# EasyEDA Pro project ReuseBlock_MSDriver2.0_2025-01-31.epro

# Schematic MSDriver2.0
Board Name: Board1; Create Date: 2025-01-27; Page Name: P1; Project Name: MSDriver(Ver2.0); Schematic Name: Schematic1; Update Date: 2025-01-29; Company: 嘉立创EDA; Page Size: A4; Version: V1.0
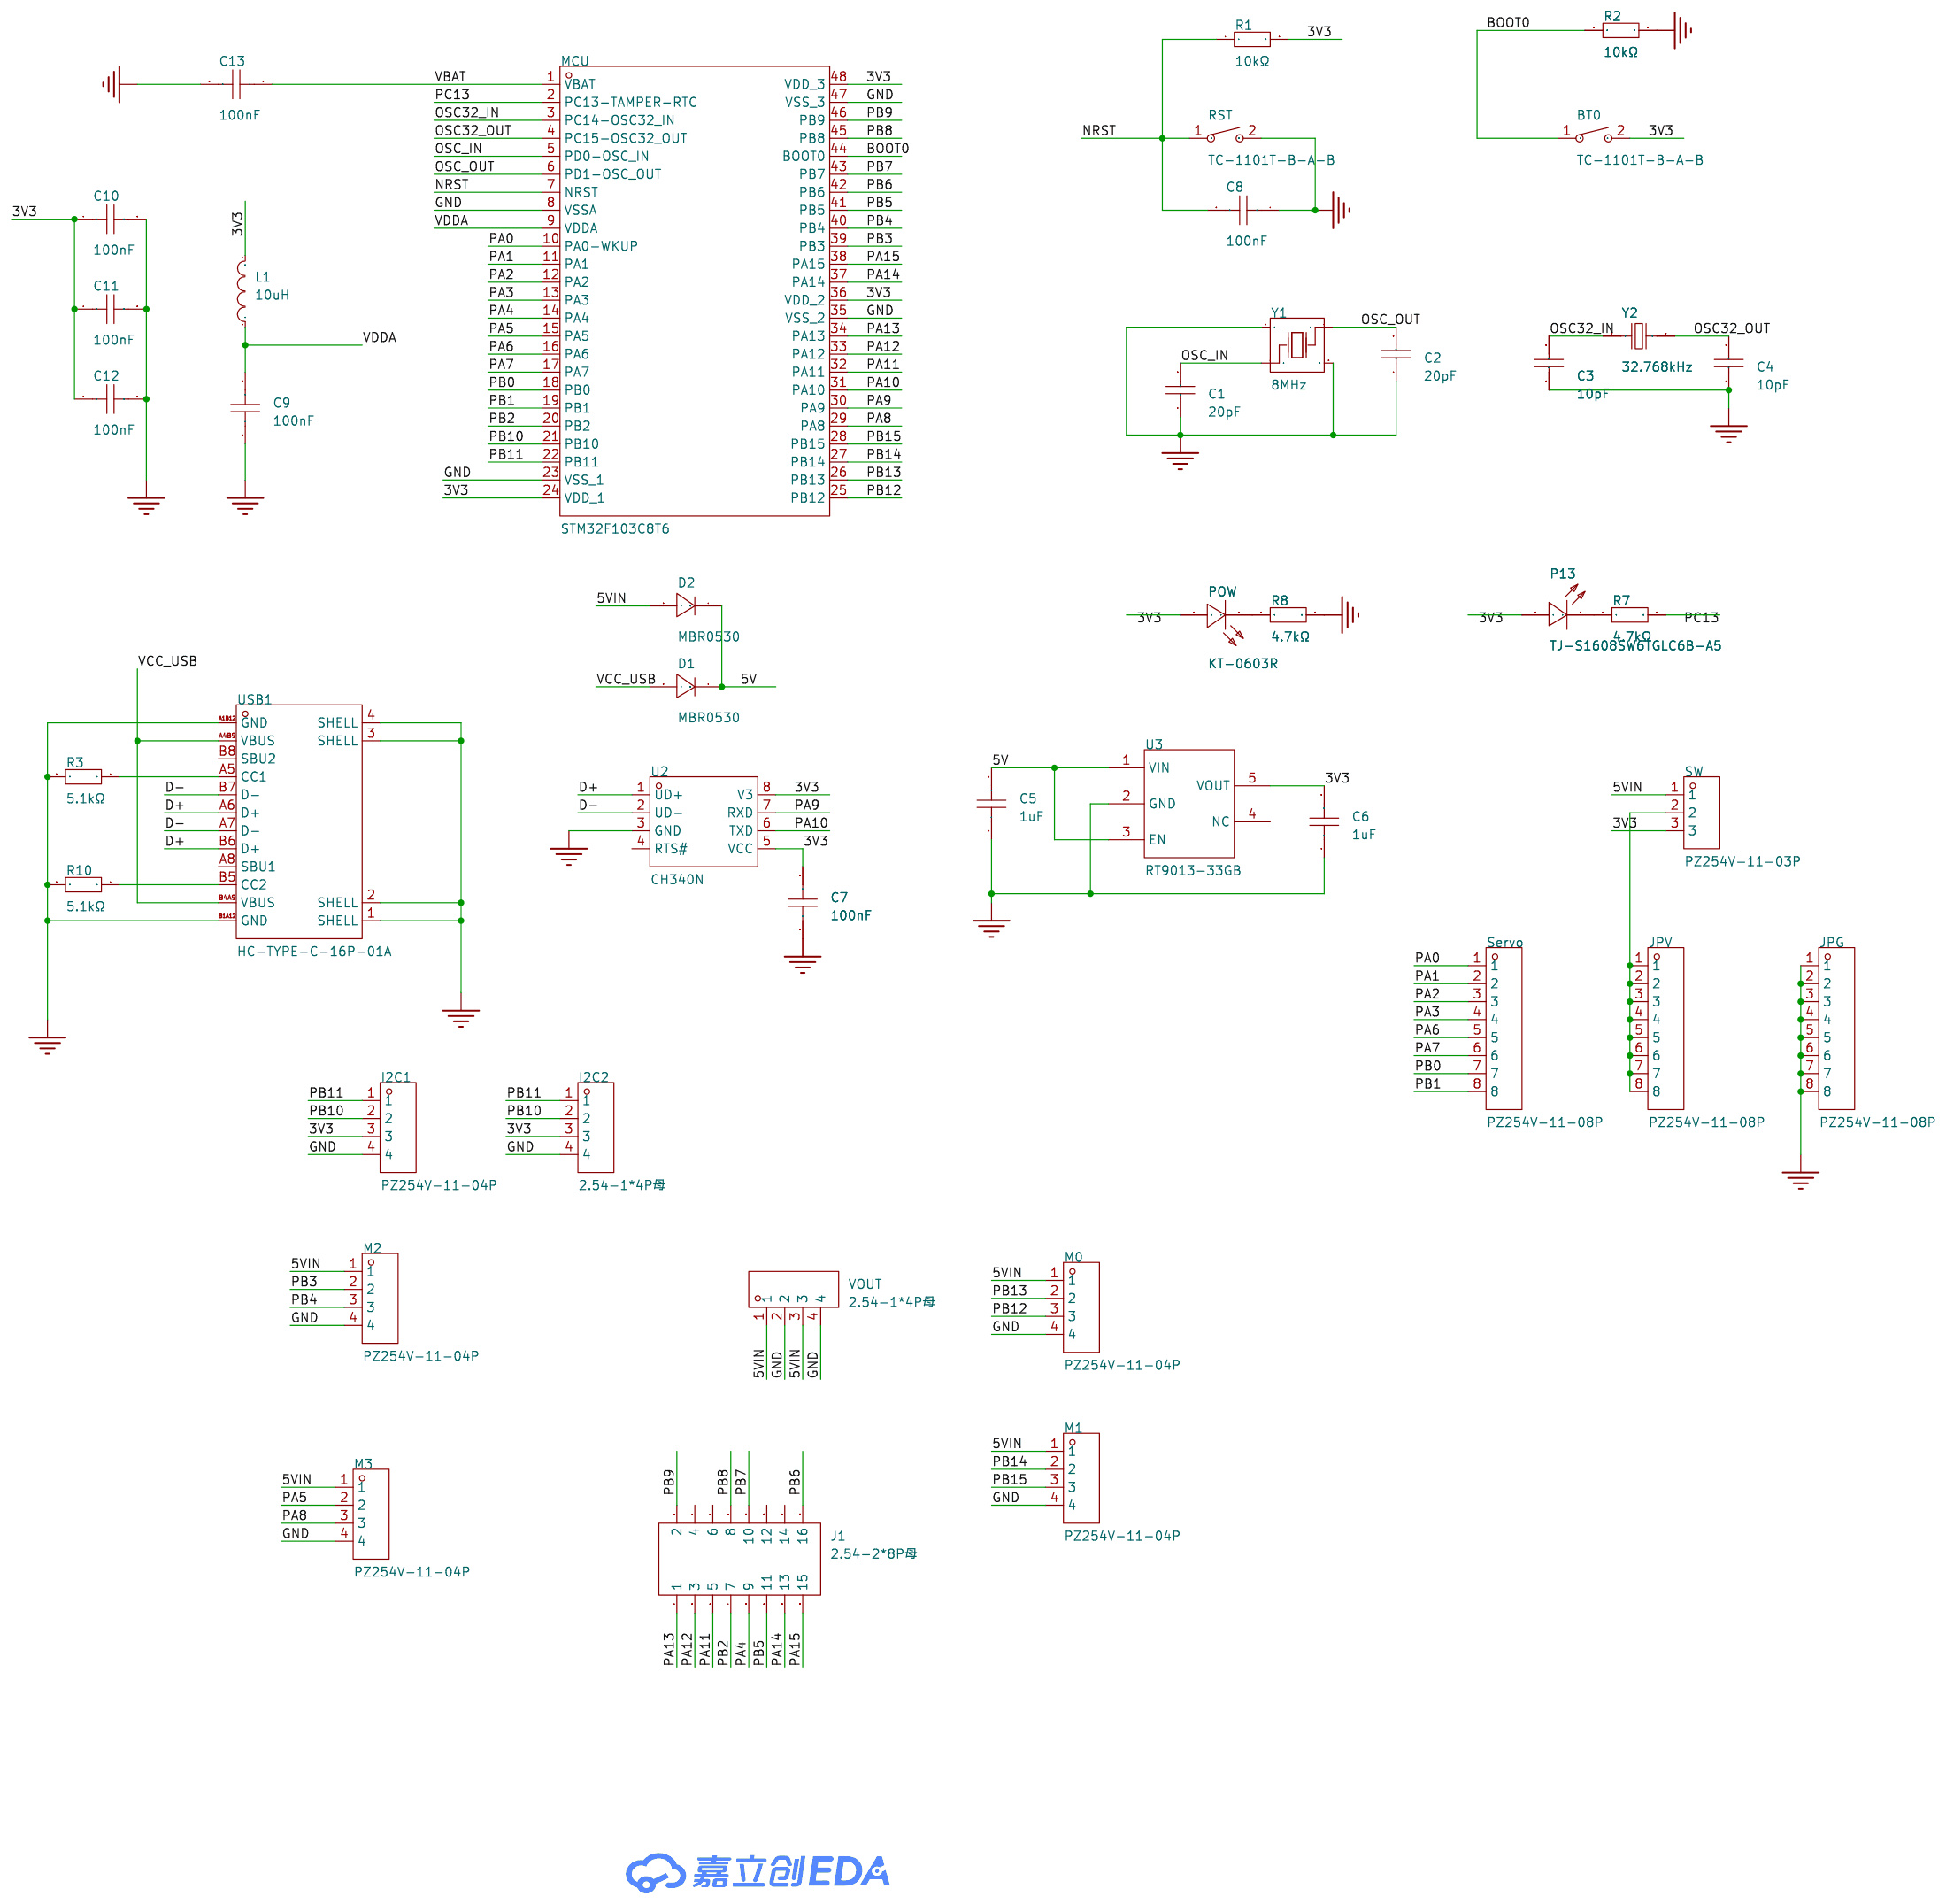
[diagram p0: schematic sheet]

## Parts
BT0  TC-1101T-B-A-B  [KEY-TH_2P-L6.0-W3.5-P6.50]
C1  20pF  [C0603]
C2  20pF  [C0603]
C3  10pF  [C0603]
C4  10pF  [C0603]
C5  1uF  [C0603]
C6  1uF  [C0603]
C7  100nF  [C0603]
C8  100nF  [C0603]
C9  100nF  [C0603]
C10  100nF  [C0603]
C11  100nF  [C0603]
C12  100nF  [C0603]
C13  100nF  [C0603]
D1  MBR0530  [SOD-123_L2.8-W1.8-LS3.7-RD]
D2  MBR0530  [SOD-123_L2.8-W1.8-LS3.7-RD]
I2C1  PZ254V-11-04P  [HDR-TH_4P-P2.54-V-M]
I2C2  2.54-1*4P母  [HDR-TH_4P-P2.54-V-F]
J1  2.54-2*8P母  [HDR-TH_16P-P2.54-V-F-R2-C8-S2.54]
JPG  PZ254V-11-08P  [HDR-TH_8P-P2.54-V-M]
JPV  PZ254V-11-08P  [HDR-TH_8P-P2.54-V-M]
L1  10uH  [L0805]
M0  PZ254V-11-04P  [HDR-TH_4P-P2.54-V-M]
M1  PZ254V-11-04P  [HDR-TH_4P-P2.54-V-M]
M2  PZ254V-11-04P  [HDR-TH_4P-P2.54-V-M]
M3  PZ254V-11-04P  [HDR-TH_4P-P2.54-V-M]
MCU  STM32F103C8T6  [LQFP-48_L7.0-W7.0-P0.50-LS9.0-BL]
P13  TJ-S1608SW6TGLC6B-A5  [LED0603-R-RD_BLUE]
POW  KT-0603R  [LED0603-RD]
R1  10kΩ  [R0603]
R2  10kΩ  [R0603]
R3  5.1kΩ  [R0603]
R7  4.7kΩ  [R0603]
R8  4.7kΩ  [R0603]
R10  5.1kΩ  [R0603]
RST  TC-1101T-B-A-B  [KEY-TH_2P-L6.0-W3.5-P6.50]
Servo  PZ254V-11-08P  [HDR-TH_8P-P2.54-V-M]
SW  PZ254V-11-03P  [HDR-TH_3P-P2.54-V-M]
U2  CH340N  [SOP-8_L4.9-W3.9-P1.27-LS6.0-BL]
U3  RT9013-33GB  [SOT-23-5_L3.0-W1.7-P0.95-LS2.8-BL]
USB1  HC-TYPE-C-16P-01A  [USB-C-SMD_HC-TYPE-C-16P-01A]
VOUT  2.54-1*4P母  [HDR-TH_4P-P2.54-V-F]
Y1  8MHz  [CRYSTAL-SMD_4P-L3.2-W2.5-BL]
Y2  32.768kHz  [FC-135R_L3.2-W1.5]

## Library data of the parts
BT0 RST = TC-1101T-B-A-B: 电路结构:单刀单掷;按钮形状:矩形按钮;作用力:160gf;安装方式:直插;开关长度:6mm;开关宽度:3.5mm;开关高度:4.3mm;带支架:不带;触点电流:50mA;额定电压(DC):12V;绝缘电阻:-;带灯:无;机械寿命:5万次;; LCSC Part Name: 6*3.5*4.3mm 直插 轻触开关; Supplier Part: C500069; Manufacturer: XKB Connectivity(中国星坤); Supplier Footprint: 插件; JLCPCB Part Class: 扩展库; Datasheet: https://atta.szlcsc.com/upload/public/pdf/source/20211011/B69A8CD93B4DADD1FF98516D35420DE2.pdf; Supplier: LCSC; Circuit: 单刀单掷; Actuator Style: 矩形按钮; Operating Force: 160gf; Mounting Style: 直插; Switch Length: 6mm; Switch Width: 3.5mm; Switch Height: 4.3mm; Strike Gundam: 不带; Contact Current: 50mA; Voltage Rating (DC): 12V; Actuator/Cap Color: 黑色; With Lamp: 无; Pin Style: PC引脚; Mechanical Life: 5万次; Operating Temperature: -20℃~+70℃
C1 C2 = CL10C200JB8NNNC: 容值:20pF;精度:±5%;额定电压:50V;材质(温度系数):C0G;; LCSC Part Name: 20pF ±5% 50V; Supplier Part: C1648; Manufacturer: SAMSUNG(三星); Supplier Footprint: 0603; JLCPCB Part Class: 基础库; Datasheet: https://atta.szlcsc.com/upload/public/pdf/source/20160218/1457707763339.pdf; Supplier: LCSC; Tolerance: ±5%; Voltage Rated: 50V; Temperature Coefficient: C0G
C3 C4 = CL10C100JB8NNNC: 容值:10pF;精度:±5%;额定电压:50V;材质(温度系数):C0G;; LCSC Part Name: 10pF ±5% 50V; Supplier Part: C1634; Manufacturer: SAMSUNG(三星); Supplier Footprint: 0603; JLCPCB Part Class: 基础库; Datasheet: https://atta.szlcsc.com/upload/public/pdf/source/20160218/1457707763339.pdf; Supplier: LCSC; Tolerance: ±5%; Voltage Rated: 50V; Temperature Coefficient: C0G
C5 C6 = CL10A105KB8NNNC: 容值:1uF;精度:±10%;额定电压:50V;材质(温度系数):X5R;; LCSC Part Name: 1uF ±10% 50V; Supplier Part: C15849; Manufacturer: SAMSUNG(三星); Supplier Footprint: 0603; JLCPCB Part Class: 基础库; Datasheet: https://atta.szlcsc.com/upload/public/pdf/source/20160218/1457707763339.pdf; Supplier: LCSC; Tolerance: ±10%; Voltage Rated: 50V; Temperature Coefficient: X5R
C7-C13 = CGA0603X7R104K500JT: 容值:100nF;精度:±10%;额定电压:50V;材质(温度系数):X7R;; LCSC Part Name: 100nF ±10% 50V; Supplier Part: C6119867; Manufacturer: HRE(芯声); Supplier Footprint: 0603; JLCPCB Part Class: 扩展库; Supplier: LCSC; Tolerance: ±10%; Voltage Rated: 50V; Temperature Coefficient: X7R
D1 D2 = MBR0530_C77336: 二极管配置:-;正向压降(Vf):550mV@500mA;直流反向耐压(Vr):30V;整流电流:500mA;; LCSC Part Name: 电压:30V 电流:500mA; Supplier Part: C77336; Manufacturer: CJ(江苏长电/长晶); Supplier Footprint: SOD-123; JLCPCB Part Class: 扩展库; Datasheet: https://atta.szlcsc.com/upload/public/pdf/source/20160702/1467448303432.pdf; Supplier: LCSC; Forward Voltage (Vf@If): 550mV@500mA; Reverse Voltage (Vr): 30V; Rectified Current: 500mA
I2C1 M0-M3 = PZ254V-11-04P: 插针结构:1x4P;间距:2.54mm;行距:-;圆针/方针:方针;安装类型:直插;排数:单排;总PIN位数:4P;额定电流:3A;额定电压:250V;配合针长度:6mm;塑高:2.5mm;端接针长度:3mm;触头材质:-;工作温度范围:-40℃~+105℃;颜色:黑色;; LCSC Part Name: 间距:2.54mm 1x4P 直插 方针; Supplier Part: C2691448; Manufacturer: XFCN(兴飞); Supplier Footprint: 插件,P=2.54mm; JLCPCB Part Class: 扩展库; Datasheet: https://atta.szlcsc.com/upload/public/pdf/source/20200309/C492403_F9F19131791D08044AD4F84F8E751A34.pdf; Supplier: LCSC; Pin Structure: 1x4P; Pitch: 2.54mm; Circluar Pins/Square Pins: 方针; Mounting Type: 直插; Number of Rows: 单排; Number of Pins: 4P; Current Rating (Max): 3A; Voltage Rating (Max): 250V; Length of Mating Pin: 6mm; Insulation Height: 2.5mm; Length of End Connection Pin: 3mm; Operating Temperature Range: -40℃~+105℃; Color: 黑色
I2C2 VOUT = 2.54-1*4P母: 插孔结构:1x4P;间距:2.54mm;行距:-;圆孔/方孔:方孔;安装类型:直插;排数:单排;总孔位数:4P;额定电流:3A;额定电压:-;插孔方向:顶部;塑高:-;触头材质:青铜;触头镀层:-;工作温度范围:-40℃~+105℃;焊接温度(最大值):-;; LCSC Part Name: 间距:2.54mm 1x4P 直插; Supplier Part: C2718488; Manufacturer: BOOMELE(博穆精密); Supplier Footprint: 插件,P=2.54mm; JLCPCB Part Class: 扩展库; Datasheet: https://atta.szlcsc.com/upload/public/pdf/source/20210301/C2718488_F4427B881E42CAA8DDB0B1C12B3A522C.pdf; Supplier: LCSC; Holes Structure: 1x4P; Pitch: 2.54mm; Circular Hole / Square Hole: 方孔; Mounting Type: 直插; Number of Rows: 单排; Number of Holes: 4P; Current Rating (Max): 3A; Holes Direction: 顶部; Contact Material: 青铜; Operating Temperature Range: -40℃~+105℃
J1 = 2.54-2*8P母: 插孔结构:2x8P;间距:2.54mm;行距:2.54mm;安装类型:直插;排数:双排;总孔位数:16P;塑高:-;触头材质:黄铜;触头镀层:-;; LCSC Part Name: 间距:2.54mm 2x8P 直插; Supplier Part: C30734; Manufacturer: BOOMELE(博穆精密); Supplier Footprint: 插件,P=2.54mm; JLCPCB Part Class: 扩展库; Datasheet: https://atta.szlcsc.com/upload/public/pdf/source/20230817/400B44B2F3F98035DBB6B63900A9163B.pdf; Supplier: LCSC; Holes Structure: 2x8P; Pitch: 2.54mm; Row Spacing: 2.54mm; Mounting Type: 直插; Number of Rows: 双排; Number of Holes: 16P; Contact Material: 黄铜
JPG JPV Servo = PZ254V-11-08P: 插针结构:1x8P;间距:2.54mm;行距:-;圆针/方针:方针;安装类型:直插;排数:单排;总PIN位数:8P;额定电流:-;额定电压:-;配合针长度:6mm;塑高:2.5mm;端接针长度:3mm;触头材质:黄铜;触头镀层:-;工作温度范围:-40℃~+105℃;颜色:黑色;; LCSC Part Name: 间距:2.54mm 1x8P 直插 方针; Supplier Part: C492407; Manufacturer: XFCN(兴飞); Supplier Footprint: 插件,P=2.54mm; JLCPCB Part Class: 扩展库; Datasheet: https://atta.szlcsc.com/upload/public/pdf/source/20200309/C492407_83A6FB26A2233368EDB9516968EC6149.pdf; Supplier: LCSC; Pin Structure: 1x8P; Pitch: 2.54mm; Circluar Pins/Square Pins: 方针; Mounting Type: 直插; Number of Rows: 单排; Number of Pins: 8P; Length of Mating Pin: 6mm; Insulation Height: 2.5mm; Length of End Connection Pin: 3mm; Contact Material: 黄铜; Operating Temperature Range: -40℃~+105℃; Color: 黑色
L1 = SDFL2012S100KTF: 电感值:10uH;精度:±10%;额定电流:15mA;饱和电流(Isat):-;直流电阻(DCR):1.15Ω;; LCSC Part Name: 10uH ±10%; Supplier Part: C1046; Manufacturer: Sunlord(顺络); Supplier Footprint: 0805; JLCPCB Part Class: 基础库; Datasheet: https://atta.szlcsc.com/upload/public/pdf/source/20231027/097A17DDB71564CE812E62F0F80142C9.pdf; Supplier: LCSC; Tolerance: ±10%; Rated Current: 15mA; DC Resistance(DCR): 1.15Ω
MCU = STM32F103C8T6: CPU内核:ARM-M3;CPU最大主频:72MHz;应用领域:-;; LCSC Part Name: 主流增强型ARM Cortex-M3 MCU，具有64 KB Flash、72 MHz CPU、电机控制、USB和CAN; Supplier Part: C8734; Manufacturer: ST(意法半导体); Supplier Footprint: LQFP-48(7x7); JLCPCB Part Class: 扩展库; Datasheet: https://atta.szlcsc.com/upload/public/pdf/source/20220812/8363ACEC51AD55ECEB84799464F7CB85.pdf; Supplier: LCSC; CPU Core: ARM-M3; CPU Maximum Speed: 72MHz; Program Storage Size: 64KB; Program Memory Type: FLASH; Number of I/O: 37; ADC (Bit): 12bit; Low Voltage Detection Threshold: 2V~3.6V
P13 = TJ-S1608SW6TGLC6B-A5: 发光颜色:蓝色;功率:111mW;正向电流:20mA;主波长:460nm;二极管配置:-;透镜颜色:无色透明透镜;色温:-;发光角度:120°;载带方式:-;工作温度:-40℃~+80℃;; LCSC Part Name: 蓝灯; Supplier Part: C192317; Manufacturer: TOGIALED(统佳); Supplier Footprint: 0603; JLCPCB Part Class: 扩展库; Datasheet: https://atta.szlcsc.com/upload/public/pdf/source/20180531/C192317_AA13A08FB08D946F89A6CA6E91343921.pdf; Supplier: LCSC; Emitted Color: 蓝色; Power Dissipation: 111mW; Forward Current: 20mA; Dominant Wavelength: 460nm; Peak Wavelength: 465nm; Lens Color: 无色透明透镜; Viewing Angle: 120°; Operating Temperature: -40℃~+80℃
POW = KT-0603R: 发光颜色:红色;功率:-;正向电流:-;主波长:-;二极管配置:-;透镜颜色:-;色温:-;发光角度:-;载带方式:-;工作温度:-40℃~+85℃;; LCSC Part Name: 0603 红灯 高亮; Supplier Part: C2286; Manufacturer: KENTO; Supplier Footprint: 0603; JLCPCB Part Class: 基础库; Datasheet: https://atta.szlcsc.com/upload/public/pdf/source/20160616/1466072038404.pdf; Supplier: LCSC; Emitted Color: 红色; Operating Temperature: -40℃~+85℃
R1 R2 = 0603WAF1002T5E: 电阻类型:厚膜电阻;阻值:10kΩ;精度:±1%;功率:100mW;最大工作电压:75V;温度系数:±100ppm/℃;; LCSC Part Name: 厚膜电阻 10kΩ ±1% 100mW; Supplier Part: C25804; Manufacturer: UNI-ROYAL(厚声); Supplier Footprint: 0603; JLCPCB Part Class: Basic Part; Datasheet: https://atta.szlcsc.com/upload/public/pdf/source/20200306/C422600_1E6D84923E4A46A82E41ADD87F860B5C.pdf; Supplier: LCSC; Type: 厚膜电阻; Tolerance: ±1%; Power(Watts): 100mW; Overload Voltage (Max): 75V; Temperature Coefficient: ±100ppm/℃; Operating Temperature Range: -55℃~+155℃
R3 R10 = 0603WAF5101T5E: 电阻类型:厚膜电阻;阻值:5.1kΩ;精度:±1%;功率:100mW;最大工作电压:75V;温度系数:±100ppm/℃;; LCSC Part Name: 5.1kΩ ±1% 100mW 厚膜电阻; Supplier Part: C23186; Manufacturer: UNI-ROYAL(厚声); Supplier Footprint: 0603; JLCPCB Part Class: Basic Part; Datasheet: https://atta.szlcsc.com/upload/public/pdf/source/20200306/C422600_1E6D84923E4A46A82E41ADD87F860B5C.pdf; Supplier: LCSC; Type: 厚膜电阻; Tolerance: ±1%; Power(Watts): 100mW; Overload Voltage (Max): 75V; Temperature Coefficient: ±100ppm/℃; Operating Temperature Range: -55℃~+155℃
R7 R8 = 0603WAF4701T5E: 电阻类型:厚膜电阻;阻值:4.7kΩ;精度:±1%;功率:100mW;最大工作电压:75V;温度系数:±100ppm/℃;; LCSC Part Name: 4.7kΩ ±1% 100mW 厚膜电阻; Supplier Part: C23162; Manufacturer: UNI-ROYAL(厚声); Supplier Footprint: 0603; JLCPCB Part Class: Basic Part; Datasheet: https://atta.szlcsc.com/upload/public/pdf/source/20200306/C422600_1E6D84923E4A46A82E41ADD87F860B5C.pdf; Supplier: LCSC; Type: 厚膜电阻; Tolerance: ±1%; Power(Watts): 100mW; Overload Voltage (Max): 75V; Temperature Coefficient: ±100ppm/℃; Operating Temperature Range: -55℃~+155℃
SW = PZ254V-11-03P: 插针结构:1x3P;间距:2.54mm;行距:-;圆针/方针:方针;安装类型:直插;排数:单排;总PIN位数:3P;额定电流:3A;额定电压:250V;配合针长度:6mm;塑高:2.5mm;端接针长度:3mm;工作温度范围:-40℃~+105℃;颜色:黑色;; LCSC Part Name: 间距:2.54mm 1x3P 直插 方针; Supplier Part: C2937625; Manufacturer: XFCN(兴飞); Supplier Footprint: 插件,P=2.54mm; JLCPCB Part Class: 扩展库; Datasheet: https://atta.szlcsc.com/upload/public/pdf/source/20200309/C492402_8335C3D49C4E4C618838D59BB1D024C1.pdf; Supplier: LCSC; Pin Structure: 1x3P; Pitch: 2.54mm; Circluar Pins/Square Pins: 方针; Mounting Type: 直插; Number of Rows: 单排; Number of Pins: 3P; Current Rating (Max): 3A; Voltage Rating (Max): 250V; Length of Mating Pin: 6mm; Insulation Height: 2.5mm; Length of End Connection Pin: 3mm; Operating Temperature Range: -40℃~+105℃; Color: 黑色
U2 = CH340N: 应用功能:USB转串口;接口协议:USB 2.0;通道数:1;数据速率:2Mbps;; LCSC Part Name: USB转串口芯片CH340; Supplier Part: C2977777; Manufacturer: WCH(南京沁恒); Supplier Footprint: SOP-8; JLCPCB Part Class: 扩展库; Datasheet: https://atta.szlcsc.com/upload/public/pdf/source/20240313/115CDE92081B1D6CB446704AD5D0F5F2.pdf; Supplier: LCSC; Applications Function: USB转串口; Protocol: USB 2.0; Number of Channels: 1; Supply Voltage: 3.3V；5V; Data Rate: 2Mbps; Operating Temperature: -20℃~+70℃
U3 = RT9013-33GB: 输出类型:固定;最大输入电压:5.5V;输出电压:3.3V;输出电流:500mA;电源纹波抑制比(PSRR):50dB@(10kHz);输出极性:正极;; LCSC Part Name: 输入5.5V 输出3.3V 500mA; Supplier Part: C47773; Manufacturer: RICHTEK(立锜); Supplier Footprint: SOT-23-5; JLCPCB Part Class: 扩展库; Datasheet: https://atta.szlcsc.com/upload/public/pdf/source/20150504/1457707282459.pdf; Supplier: LCSC; Output Type: 固定; Maximum Input Voltage: 5.5V; Output Voltage: 3.3V; Output Current: 500mA; Power Supply Rejection Ratio (PSRR): 50dB@(10kHz); Dropout Voltage: 400mV@(500mA); standby current: 50uA; Feature: 低ESR；防静电保护；热保护(TSD)；过流保护(OCP)；带使能; Operating Temperature: -40℃~+85℃; Output Polarity: 正极; Number of Outputs: 1
USB1 = HC-TYPE-C-16P-01A: 连接器类型:Type-C;标准:-;公母:母;安装方式:卧贴;触点数量:16P;端口数量:1;额定电流 - 电源:5A;触头材质:铜;触头镀层:金;工作温度范围:-55℃~+85℃;焊接温度(最大值):260℃;; LCSC Part Name: Type-C 母 卧贴; Supplier Part: C2894897; Manufacturer: HCTL(华灿天禄); Supplier Footprint: SMD; JLCPCB Part Class: 扩展库; Datasheet: https://atta.szlcsc.com/upload/public/pdf/source/20221116/CF1C0058359F0761D6F7BB69303000BD.pdf; Supplier: LCSC; Connector Type: Type-C; Gender: 母; Mounting Style: 卧贴; Number of Contacts: 16P; Number of Ports: 1; Current Rating - Power (Max): 5A; Contact Material: 铜; Contact Plating: 金; Operating Temperature Range: -55℃~+85℃; Soldering Temperature(Max): 260℃
Y1 = TAXM8M4RDBCCT2T: 晶振类型:贴片晶振;频率:8MHz;常温频差:±10ppm;负载电容:10pF;频率稳定度(全温):±15ppm;; LCSC Part Name: 8MHz ±10ppm 10pF; Supplier Part: C400090; Manufacturer: YJX(雅晶鑫); Supplier Footprint: SMD3225-4P; JLCPCB Part Class: 扩展库; Datasheet: https://atta.szlcsc.com/upload/public/pdf/source/20190626/C400090_CF95B89E745AFE4EF2E392EF8AC009D6.pdf; Supplier: LCSC; Crystal Type: 贴片晶振; Normal temperature Frequency Tolerance: ±10ppm; Load Capacitor: 10pF; Frequency Stability(Full temperature range): ±15ppm; Equivalent Series Resistance (ESR): 250Ω; Operating Temperature: -40℃~+85℃
Y2 = Q13FC13500004_C32346: 晶振类型:贴片晶振;频率:32.768kHz;常温频差:±20ppm;负载电容:12.5pF;; LCSC Part Name: 32.768kHz ±20ppm 12.5pF; Supplier Part: C32346; Manufacturer: EPSON(爱普生); Manufacturer Part: Q13FC13500004; Supplier Footprint: SMD3215-2P; JLCPCB Part Class: 基础库; Datasheet: https://atta.szlcsc.com/upload/public/pdf/source/20240418/0E0FF5F0356BA3753F616001439D1416.pdf; Supplier: LCSC; Crystal Type: 贴片晶振; Normal temperature Frequency Tolerance: ±20ppm; Load Capacitor: 12.5pF; Equivalent Series Resistance (ESR): 70kΩ; Operating Temperature: -40℃~+85℃

## Nets
3V3: BT0.2 C6.2 C7.2 C10.1 C11.1 C12.1 I2C1.3 I2C2.3 L1.2 MCU.24(VDD_1) MCU.36(VDD_2) MCU.48(VDD_3) P13.1(A) POW.2(A) R1.2 SW.3 U2.5(VCC) U2.8(V3) U3.5(VOUT)
5V: C5.2 D1.1(C) D2.1(C) U3.1(VIN) U3.3(EN)
5VIN: D2.2(A) M0.1 M1.1 M2.1 M3.1 SW.1 VOUT.1 VOUT.3
GND: C1.1 C2.1 C3.1 C4.1 C5.1 C6.1 C7.1 C8.1 C9.1 C10.2 C11.2 C12.2 C13.2 I2C1.4 I2C2.4 JPG.1 JPG.2 JPG.3 JPG.4 JPG.5 JPG.6 JPG.7 JPG.8 M0.4 M1.4 M2.4 M3.4 MCU.8(VSSA) MCU.23(VSS_1) MCU.35(VSS_2) MCU.47(VSS_3) R2.2 R3.2 R8.2 R10.2 RST.2 U2.3(GND) U3.2(GND) USB1.1(SHELL) USB1.2(SHELL) USB1.3(SHELL) USB1.4(SHELL) USB1.A1B12(GND) USB1.B1A12(GND) VOUT.2 VOUT.4 Y1.2 Y1.4
VBAT: C13.1 MCU.1(VBAT)
VCC_USB: D1.2(A) USB1.A4B9(VBUS) USB1.B4A9(VBUS)
VDDA: C9.2 L1.1 MCU.9(VDDA)
BOOT0: BT0.1 MCU.44(BOOT0) R2.1
D+: U2.1(UD+) USB1.A6(D+) USB1.B6(D+)
D-: U2.2(UD-) USB1.A7(D-) USB1.B7(D-)
NRST: C8.2 MCU.7(NRST) R1.1 RST.1
OSC32_IN: C3.2 MCU.3(PC14-OSC32_IN) Y2.1
OSC32_OUT: C4.2 MCU.4(PC15-OSC32_OUT) Y2.2
OSC_IN: C1.2 MCU.5(PD0-OSC_IN) Y1.1
OSC_OUT: C2.2 MCU.6(PD1-OSC_OUT) Y1.3
PA0: MCU.10(PA0-WKUP) Servo.1
PA1: MCU.11(PA1) Servo.2
PA2: MCU.12(PA2) Servo.3
PA3: MCU.13(PA3) Servo.4
PA4: J1.9 MCU.14(PA4)
PA5: M3.2 MCU.15(PA5)
PA6: MCU.16(PA6) Servo.5
PA7: MCU.17(PA7) Servo.6
PA8: M3.3 MCU.29(PA8)
PA9: MCU.30(PA9) U2.7(RXD)
PA10: MCU.31(PA10) U2.6(TXD)
PA11: J1.5 MCU.32(PA11)
PA12: J1.3 MCU.33(PA12)
PA13: J1.1 MCU.34(PA13)
PA14: J1.13 MCU.37(PA14)
PA15: J1.15 MCU.38(PA15)
PB0: MCU.18(PB0) Servo.7
PB1: MCU.19(PB1) Servo.8
PB2: J1.7 MCU.20(PB2)
PB3: M2.2 MCU.39(PB3)
PB4: M2.3 MCU.40(PB4)
PB5: J1.11 MCU.41(PB5)
PB6: J1.16 MCU.42(PB6)
PB7: J1.10 MCU.43(PB7)
PB8: J1.8 MCU.45(PB8)
PB9: J1.2 MCU.46(PB9)
PB10: I2C1.2 I2C2.2 MCU.21(PB10)
PB11: I2C1.1 I2C2.1 MCU.22(PB11)
PB12: M0.3 MCU.25(PB12)
PB13: M0.2 MCU.26(PB13)
PB14: M1.2 MCU.27(PB14)
PB15: M1.3 MCU.28(PB15)
PC13: MCU.2(PC13-TAMPER-RTC) R7.2
Net-(JPV-1): JPV.1 JPV.2 JPV.3 JPV.4 JPV.5 JPV.6 JPV.7 JPV.8 SW.2
Net-(P13-2): P13.2(K) R7.1
Net-(POW-1): POW.1(K) R8.1
Net-(R3-1): R3.1 USB1.A5(CC1)
Net-(R10-1): R10.1 USB1.B5(CC2)

Not connected (* = marked no-connect by the designer): J1 4 6 12 14; U2 4(RTS#); U3 4(NC); USB1 A8(SBU1) B8(SBU2)
